# Altium schematic sheet Placa 5 (Sensores).SchDoc
size A4; SheetNumber: 1; SheetTotal: 1
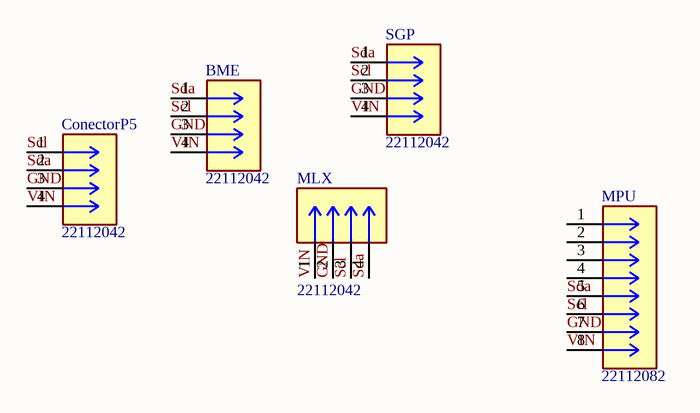
[diagram p0: Placa 5 (Sensores).SchDoc]

## Parts
BME  22112042  [CONN_A-6373-04A_MOL]
ConectorP5  22112042  [CONN_A-6373-04A_MOL]
MLX  22112042  [CONN_A-6373-04A_MOL]
MPU  22112082  [CONN_A-6373-08A_MOL]
SGP  22112042  [CONN_A-6373-04A_MOL]

## Nets
GND: BME.3 ConectorP5.3 MLX.2 MPU.7 SGP.3
Scl: BME.2 ConectorP5.1 MLX.3 MPU.6 SGP.2
Sda: BME.1 ConectorP5.2 MLX.4 MPU.5 SGP.1
VIN: BME.4 ConectorP5.4 MLX.1 MPU.8 SGP.4

Not connected (* = marked no-connect by the designer): MPU 1 2 3 4

## Library data of the parts
MPU = 22112082: KKÂ® 254 Solid Header, Vertical, with Friction Lock, 8 Circuits, Gold (Au) Plating; MF: Molex; SnapEDA_Link: https://www.snapeda.com/parts/22-11-2082/Molex/view-part/?ref=snap; Package: None; Value: *; MP: 22-11-2082; Check_prices: https://www.snapeda.com/parts/22-11-2082/Molex/view-part/?ref=eda
BME ConectorP5 MLX SGP = 22112042: Package: None; Price: None; Value: *; MP: 22112042; Availability: Unavailable